# Altium project Mini Pi Board.PrjPcb
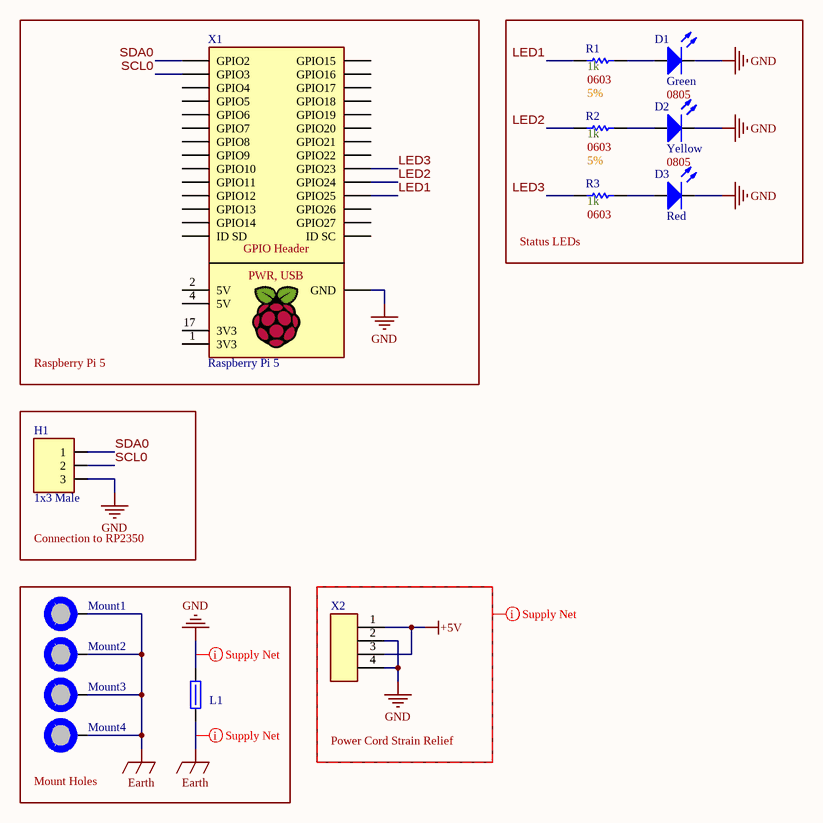
[diagram p0: Main.SchDoc]
1 sheet, 14 parts. Net scope: global (net labels, ports and power ports of the same name join across sheets).
Board file: Main.PcbDoc

## Sheet Main.SchDoc
size A; SheetNumber: 1; SheetTotal: 1

### Parts
D1  Color: Green  Size Package: 0805  [[LED] SMD 0805]  (hidden comment: SMD LED)
D2  Color: Yellow  Size Package: 0805  [[LED] SMD 0805]  (hidden comment: SMD LED)
D3  Color: Red  [[LED] SMD 0805]  (hidden comment: SMD LED)
H1  1x3 Male  [[Header] Shrouded 1x3 Male]
L1  652-MH2029-300Y  [[Ferrite] SMD Bead 0805 (1)]  (value not drawn)
Mount1  M3 Mount Hole  [[Mount] M3 Mount Hole]  (value not drawn)  (no BOM)
Mount2  M3 Mount Hole  [[Mount] M3 Mount Hole]  (value not drawn)  (no BOM)
Mount3  M3 Mount Hole  [[Mount] M3 Mount Hole]  (value not drawn)  (no BOM)
Mount4  M3 Mount Hole  [[Mount] M3 Mount Hole]  (value not drawn)  (no BOM)
R1  Resistance: 1k  Size Package: 0603  Tolerance: 5%  [[Res] SMD 0603]  (hidden comment: [Res] SMD Resistor)
R2  Resistance: 1k  Size Package: 0603  Tolerance: 5%  [[Res] SMD 0603]  (hidden comment: [Res] SMD Resistor)
R3  Resistance: 1k  Size Package: 0603  [[Res] SMD 0603]  (hidden comment: [Res] SMD Resistor)
X1  Raspberry Pi 5  [[Device] Raspberry Pi 5]
X2  4pin Screw Terminal  [[Screw Terminal] 4pin 5mm]  (value not drawn)

### Blocks framed on the sheet
Raspberry Pi 5: X1
Status LEDs: D1-D3 R1-R3
Connection to RP2350: H1
Mount Holes: L1 Mount1-Mount4
Power Cord Strain Relief: X2

### Nets
+5V: X2.1 X2.3
Earth: L1.1 Mount1.1 Mount2.1 Mount3.1 Mount4.1
GND: D1.2(Cathode) D2.2(Cathode) D3.2(Cathode) H1.3 L1.2 X1.GND X2.2 X2.4
LED1: R1.2 X1.22(GPIO25)
LED2: R2.2 X1.18(GPIO24)
LED3: R3.2 X1.16(GPIO23)
SCL0: H1.2 X1.5(GPIO3)
SDA0: H1.1 X1.3(GPIO2)
NetD1_1: D1.1(Anode) R1.1
NetD2_1: D2.1(Anode) R2.1
NetD3_1: D3.1(Anode) R3.1

Not connected (* = marked no-connect by the designer): X1 1(3V3) 2(5V) 4(5V) 7(GPIO4) 8(GPIO14) 10(GPIO15) 11(GPIO17) 12(GPIO18) 13(GPIO27) 15(GPIO22) 17(3V3) 19(GPIO10) 21(GPIO9) 23(GPIO11) 24(GPIO7) 26(GPIO8) 27(ID_SD) 28(ID_SC) 29(GPIO5) 31(GPIO6) 32(GPIO12) 33(GPIO13) 35(GPIO19) 36(GPIO16) 37(GPIO26) 38(GPIO20) 40(GPIO21)

### Layout directives
net class Supply_Nets: +5V, Earth, GND

### Notes on the sheet
- (in symbol [Device] Raspberry Pi 5) GPIO Header; PWR, USB

### Library data of the parts
D1-D3 = [LED] SMD: Generic; Part #: *; Supplier 1: DigiKey
  D1: Supplier Part Number 1: 475-LGR971-KN-1CT-ND
  D2: Supplier Part Number 1: 475-LYR976-PS-36-0-20-R18CT-ND
  D3: Supplier Part Number 1: 475-LSR976-NR-1CT-ND
H1 = [Header] Shrouded 1x3 Male: 070543-0037 / Mates with 005057-9403; Supplier 1: DigiKey; Supplier 2: DigiKey; Supplier Part Number 1: WM4825-ND; Supplier Part Number 2: WM2901-ND
L1 = [Ferrite] SMD Ferrite Bead (1): Res @ Freq: 30 @ 100MHz; Size Package: 0805; Supplier 1: DigiKey; Supplier Part Number 1: MH2029-300YCT-ND
Mount1-Mount4 = [Mount] M3 Mount Hole: Place at least 4.5mm from board edge. Plated.
R1-R3 = [Res] SMD Resistor: Generic; Supplier 1: DigiKey; Supplier Part Number 1: RMCF0603FT1K00DKR-ND
X1 = [Device] Raspberry Pi 5: Supplier 1: DigiKey; Supplier Part Number 1: XG4H-4034-ND
X2 = [Screw Terminal] 4pin: Supplier 1: DigiKey; Supplier Part Number 1: 102-6147-ND